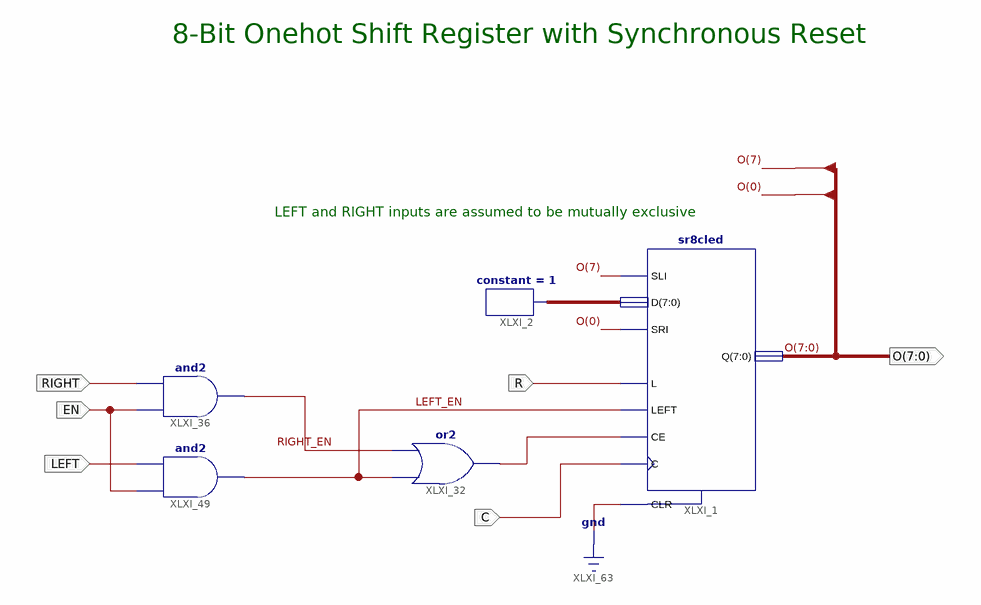
[diagram p0: schematic sheet 1]
// Xilinx ISE schematic onehotsr8r.sch (spartan6) as structural Verilog: 5 symbols, 6 ports
module onehotsr8r (
  input  C,
  input  R,
  input  LEFT,
  input  RIGHT,
  input  EN,
  output [7:0] O
);

  wire LEFT_EN, RIGHT_EN, XLXN_54;
  wire [7:0] XLXN_1;

  sr8cled XLXI_1 (.C(C), .CE(XLXN_54), .CLR(1'b0), .D(XLXN_1), .L(R), .LEFT(LEFT_EN), .SLI(O[7]), .SRI(O[0]), .Q(O));
  or XLXI_32 (XLXN_54, LEFT_EN, RIGHT_EN);
  constant #(.CValue("1")) XLXI_2 (.O(XLXN_1));
  and XLXI_49 (LEFT_EN, EN, LEFT);
  and XLXI_36 (RIGHT_EN, EN, RIGHT);

  // Notes on the sheet:
  //   8-Bit Onehot Shift Register with Synchronous Reset
  //   LEFT and RIGHT inputs are assumed to be mutually exclusive
endmodule
